# Altium schematic sheet Barometer.SchDoc: Barometer
size 203 x 127 mm; DrawnBy: Kace Chandler; DocumentNumber: 5; SheetNumber: 5; SheetTotal: 23
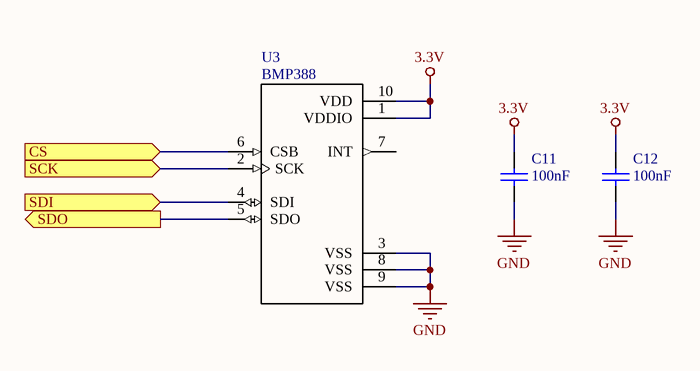
[diagram p0: Barometer.SchDoc]

## Parts
C11  value 100nF  [0603 to 0805 SMD]  (hidden comment: Cap)
C12  value 100nF  [0603 to 0805 SMD]  (hidden comment: Cap)
U3  BMP388  [PQFN50P200X200X80-10N]

## Ports
CS (in), SCK (in), SDI (in), SDO (out)

## Nets
3.3V: C11.2 C12.2 U3.1(VDDIO) U3.10(VDD)
GND: C11.1 C12.1 U3.3(VSS) U3.8(VSS) U3.9(VSS)
CS: U3.6(CSB) ; port CS
SCK: U3.2(SCK) ; port SCK
SDI: U3.4(SDI) ; port SDI
SDO: U3.5(SDO) ; port SDO

Not connected (* = marked no-connect by the designer): U3 7(INT)

## Library data of the parts
U3 = BMP388: P-Sensor SPI I2C 1, 25 Bar SMD; MF: Bosch Sensortec; Availability: Unavailable; MP: BMP388; SnapEDA_Link: https://www.snapeda.com/parts/BMP388/Bosch%20Sensortec/view-part/?ref=snap; Package: WFLGA-10 Bosch Tools; Price: None; Value: *; Supplier 1: Digi-Key; Supplier Part Number 1: 828-1079-1-ND